# Altium schematic sheet 2W5_Audio_amp.SchDoc
size A; SheetNumber: 4
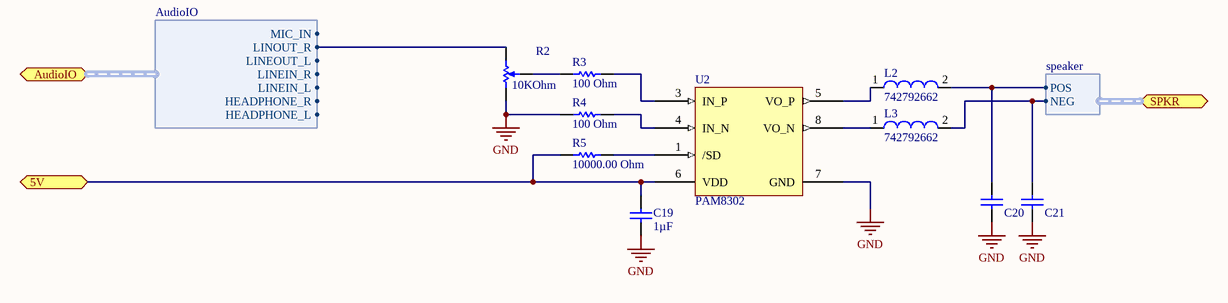
[diagram p0: 2W5_Audio_amp.SchDoc]

## Parts
C19  Capacitance: 1µF  [CAPC1005X55X10ML05]  (hidden comment: C1005X5R1C105K050BC)
C20  CAP 220pF 16V 0402(1005)  [CAPC0402(1005)60_N]  (value not drawn)
C21  CAP 220pF 16V 0402(1005)  [CAPC0402(1005)60_N]  (value not drawn)
L2  742792662  [SMD-0603]
L3  742792662  [SMD-0603]
R2  Resistance: 10KOhm  [BOUR-TC33X-2_V]  (hidden comment: TC33X-2-103E)
R3  value 100 Ohm  [RESC0402(1005)_N]  (hidden comment: 2K 5% 0402(1005))
R4  value 100 Ohm  [RESC0402(1005)_N]  (hidden comment: 2K 5% 0402(1005))
R5  value 10000.00 Ohm  [RESC0402(1005)_N]  (hidden comment: 2K 5% 0402(1005))
U2  PAM8302  [MSOP-8N]

## Ports
5V, AudioIO (harness AudioIO), SPKR (harness speaker)

## Harnesses
AudioIO: HEADPHONE_L, HEADPHONE_R, LINEIN_L, LINEIN_R, LINEOUT_L, LINOUT_R, MIC_IN
speaker: POS, NEG

## Nets
GND: C19.2 C20.1 C21.1 R2.1 R4.1 U2.7(GND)
5V: C19.1 R5.1 U2.6(VDD) ; port 5V
NetC20_2: C20.2 L2.2 ; port SPKR.POS
NetC21_2: C21.2 L3.2 ; port SPKR.NEG
NetL2_1: L2.1 U2.5(VO_P)
NetL3_1: L3.1 U2.8(VO_N)
NetR2_2: R2.2 R3.1
NetR2_3: R2.3 ; port AudioIO.LINOUT_R
NetR3_2: R3.2 U2.3(IN_P)
NetR4_2: R4.2 U2.4(IN_N)
NetR5_2: R5.2 U2.1(/SD)

## Library data of the parts
C19 = CMP-2000-05003-1: Chip Capacitor, 1 uF, +/- 10%, 16 V, -55 to 85 degC, 0402 (1005 Metric), RoHS, Tape and Reel; PCN Part Number: MLCCPartNumberChange30/Nov/2012; Manufacturer: TDK; HOUSEPART: MF-CAP-0402-1uF; Online Catalog: CSeries,GeneralPurpose; Other Names: 445-4978-6; Temperature Coefficient: X5R; Product Training Modules: CSeriesGeneralApplicationsSEAT,CCV,andTVCLDesignToolsGuidetoReplacinganElectrolyticCapacitorwithanMLCC; Voltage - Rated: 16V; Packaging: Digi-Reel; Tolerance: ±10%; Lead Spacing: -; Size / Dimension: 0.039"Lx0.020"W(1.00mmx0.50mm); Lead Style: -; Operating Temperature: -55degC~85degC; Series: C; Datasheet Version: Oct-13; Applications: GeneralPurpose; Family: CeramicCapacitors; Height - Seated (Max): -; Standard Package: 1; RoHS Information: RoHSCertificate-MLCC; Ratings: -; Package Description: 2-Pin Surface Mount Device, Body 1 x 0.5 mm; Package / Case: 0402(1005Metric); Category: Capacitors; Package Reference: 402; Datasheet URL: https://datasheet.ciiva.com/14482/1756136-14482760.pdf; Manufacturer URL: http://www.tdk.com/; Features: -; Mounting Type: SurfaceMount,MLCC; Thickness (Max): 0.022"(0.55mm); Supplier 1: Digi-Key; Supplier Part Number 1: 445-4978-1-ND
C20 C21 = CMP-1034-01360-1: CAP 220pF 16V ±10% 0402 (1005 Metric) Thickness 0.6mm SMD; Tolerance: Â±10%; Case-Metric: 1005; Case-EIA: 0402; Rated Voltage: 16 V; Max Thickness: 0.6 mm; Technology: SMT; Value: 220pF; Supplier 1: Digi-Key; Supplier Part Number 1: 732-7516-1-ND
L2 L3 = CMP-0220-00178-1: SMD EMI Suppression Ferrite Bead WE-CBF, Z = 1000 Ohm; PackageDescription: Chip Inductor, 2-Leads, Body 1.6 x 0.8 mm; PackageVersion: 2009; PackageReference: SMD-0603; ComponentLink1URL: http://www.we-online.com; ComponentLink2URL: http://www.we-online.de/katalog/media/pdf/742792662.pdf; Impedance: 1000 Ohm; DatasheetVersion: ver 1, Mar-2010; ComponentLink1Description: Manufacturer Link; ComponentLink2Description: Datasheet; Supplier 1: Digi-Key; Supplier Part Number 1: 732-1585-1-ND
R2 = CMP-2100-03695-1: Trimming Potentiometer, 10000 Ohm, -40 to 100 degC, 3-Pin SMD, RoHS, Tape and Reel; Manufacturer: Bourns; Tolerance: 25%; Max Power Dissipation: 100mW; Number of Turns: 1; Temperature Coefficient: 250ppm/degreesC; Voltage Rating (DC): 50V; Datasheet URL: http://www.bourns.com/docs/Product-Datasheets/TC33.pdf; Composition: Potentiometer; Package Description: 3-Pin Surface Mount Device, Body 3.8 x 3.6 mm; Weight: 29.4mg; Power Rating: 100mW; Termination: FootPrint; Manufacturer URL: http://www.bourns.com/; Width: 0.118inch; Height: 0.047inch; Military Standard: Not; Radiation Hardening: No; Colour: Silver; Case/Package: SMD/SMT; Depth: 3.8mm; Min Operating Temperature: -40degC; Lead Free: LeadFree; Datasheet Version: 42583.0; REACH SVHC: NoSVHC; Length: 3mm; RoHSCompliant: true; Contact Plating: Silver; Taper: Linear; Packaging: TapeandReel; Mount: SurfaceMount; Max Operating Temperature: 100degC; Package Reference: TC33X-2; Package Quantity: 2500; Supplier 1: Digi-Key; Supplier Part Number 1: TC33X-103ECT-ND
R3 R4 = CMP-1011-00081-1: 100 0.063W 5% 0402 (1005 Metric)  SMD; HOUSEPART: MF-RES-0402-100; Case-EIA: 0402; Case-Metric: 1005; Power: 0.063 W; Technology: SMT; Tolerance: 5 %; Supplier 1: Digi-Key; Supplier Part Number 1: P100JCT-ND
R5 = CMP-1011-00081-1: 10K 0.063W 5% 0402 (1005 Metric)  SMD; HOUSEPART: MF-RES-0402-10K; Case-EIA: 0402; Case-Metric: 1005; Power: 0.063 W; Technology: SMT; Tolerance: 5 %; Supplier 1: Digi-Key; Supplier Part Number 1: P10KJCT-ND
U2 = Component_1: Manufacturer: Diodes Incorporated; Voltage Input: 2 V ~ 5.5 V; Max Output: 2.5W x 1 @ 4 Ohm; Operating Temp: -40°C ~ 85°C; datasheet: https://www.diodes.com/assets/Datasheets/PAM8302A.pdf; Supplier 1: Digi-Key; Supplier Part Number 1: PAM8302AASCRDI-ND